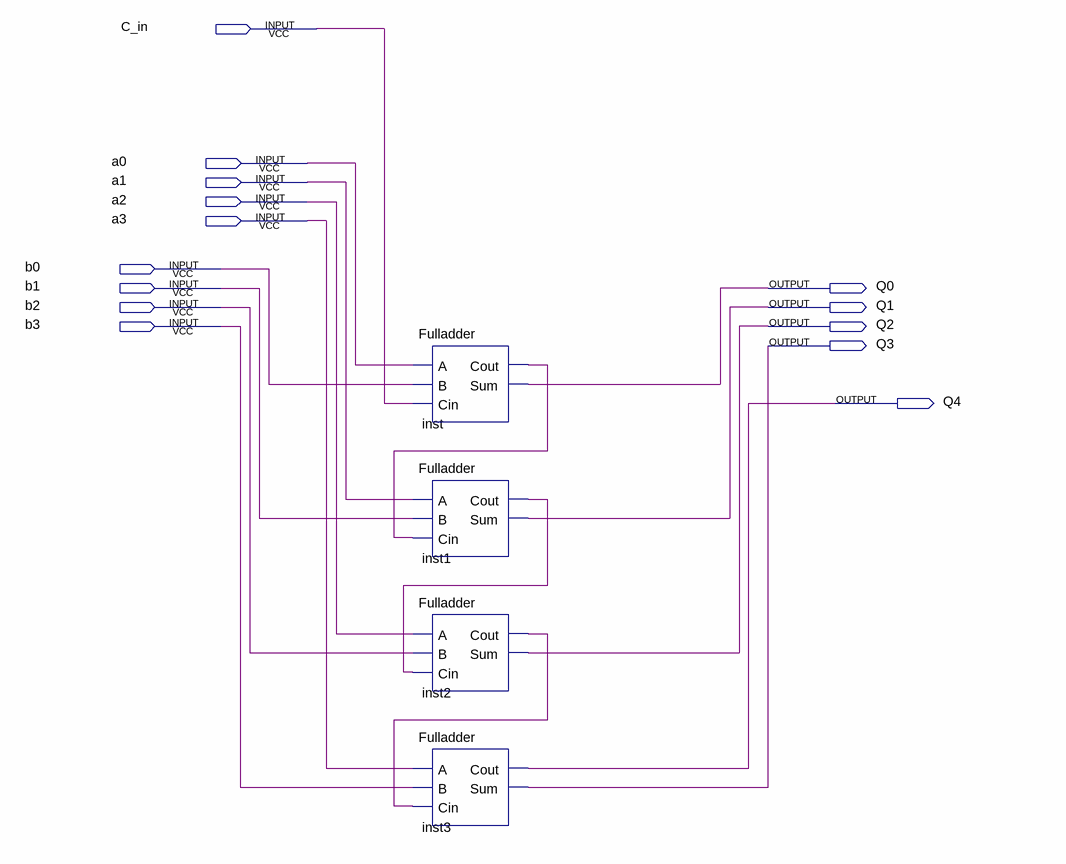
[diagram p0: schematic sheet]
// Quartus schematic 4BITADDER.bdf as structural Verilog: 4 symbols, 14 pins
module \4BITADDER  (
  input  C_in,
  input  a0,
  input  a1,
  input  a2,
  input  a3,
  input  b0,
  input  b1,
  input  b2,
  input  b3,
  output Q0,
  output Q1,
  output Q2,
  output Q3,
  output Q4
);

  wire inst1_cout, inst2_cout, inst_cout;

  Fulladder inst (.A(a0), .B(b0), .Cin(C_in), .Cout(inst_cout), .Sum(Q0));
  Fulladder inst1 (.A(a1), .B(b1), .Cin(inst_cout), .Cout(inst1_cout), .Sum(Q1));
  Fulladder inst2 (.A(a2), .B(b2), .Cin(inst1_cout), .Cout(inst2_cout), .Sum(Q2));
  Fulladder inst3 (.A(a3), .B(b3), .Cin(inst2_cout), .Cout(Q4), .Sum(Q3));
endmodule
